# Altium schematic sheet SUPPLY_IN.SchDoc
size A4
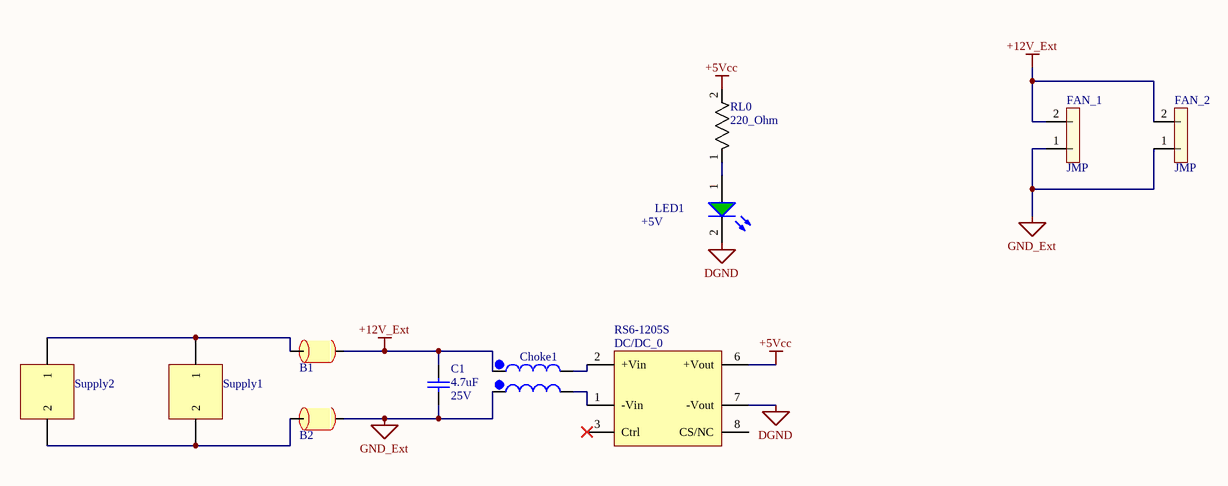
[diagram p0: SUPPLY_IN.SchDoc]

## Parts
B1  Bead  [RES_1206]  (value not drawn)
B2  Bead  [RES_1206]  (value not drawn)
C1  4.7uF  Voltage: 25V  [CAP_0805]
Choke1  (no value)  [Choque SMD]
DC/DC_0  RS6-1205S  [DC/DC SIP-8]
FAN_1  JMP  [Terminal Block 2 pos 8A]
FAN_2  JMP  [Terminal Block 2 pos 8A]
LED1  +5V  [LED_0805]
RL0  220_Ohm  [res_0805]
Supply1  649006227222_1X2  [Conector tipo ATX Wurth 2 posiciones angulo recto]  (value not drawn)
Supply2  649006227222_1X2  [Conector tipo ATX Wurth 2 posiciones angulo recto]  (value not drawn)

## Nets
+5Vcc: DC/DC_0.6(+Vout) RL0.2(A)
+12V_Ext: B1.2 C1.1 Choke1.1 FAN_1.2 FAN_2.2
DGND: DC/DC_0.7(-Vout) LED1.2(C)
GND_Ext: B2.2 C1.2 Choke1.4 FAN_1.1 FAN_2.1
NetB1_1: B1.1 Supply1.1 Supply2.1
NetB2_1: B2.1 Supply1.2 Supply2.2
NetChoke1_2: Choke1.2 DC/DC_0.2(+Vin)
NetChoke1_3: Choke1.3 DC/DC_0.1(-Vin)
NetLED1_1: LED1.1(A) RL0.1(C)

Not connected (* = marked no-connect by the designer): DC/DC_0 3(Ctrl)* 8(CS/NC)

## Library data of the parts
B1 B2 = Bead: FERRITE BEAD 60 OHM 1206 1LN; Digi-Key Part Number: 587-1770-1-ND
C1 = Cap_0805: Capacitor; Manufacturer Part-Number: CL21A475KAQNNNE; Digikey Part-Number: 1276-1244-1-ND; Value: 4.7uF
Choke1 = Choque bourns SMD: 1.5A; Manufacturer Part-Number: SRF0504-102Y; Digikey Part-Number: SRF0504-102YCT-ND
DC/DC_0 = DC/DC SIP-8 1Output: DC DC CONVERTER 5V 6W; Digi-Key Part Number: 945-2984-ND; Manufacturer Part-Number: RS6-1205S
FAN_1 FAN_2 = jumper2pos: TERM BLOCK 2POS SIDE ENT 2.54MM / FAN AXIAL 40X15MM 12VDC WIRE; Digi-Key Part Number: 277-1764-ND; Manufacturer Part Number 2: 1988804
LED1 = WL-SMCW 0805  150080GS75000: LED BLUE CLEAR 0805 SMD; Manufacturer Part Number: 150080BS75000; Digi-Key Part Number: 732-4982-1-ND; RS Part Number: 815-4231
RL0 = RES_ERJ-3GEYJ471V: 1% 1/4W 0805; Manufacturer Part Number: RC0603FR-07220RL; Digi-Key Part Number: 311-220HRCT-ND; RS Part Number: *
Supply1 Supply2 = 649006227222_1X2: Manufacturer Part Number: 649002227222; Digi-Key Part Number: 732-1937-ND